# Altium schematic sheet REG_LIN_3V3_1A_TPS78533.SchDoc
size A4; SheetNumber: 4; SheetTotal: 4
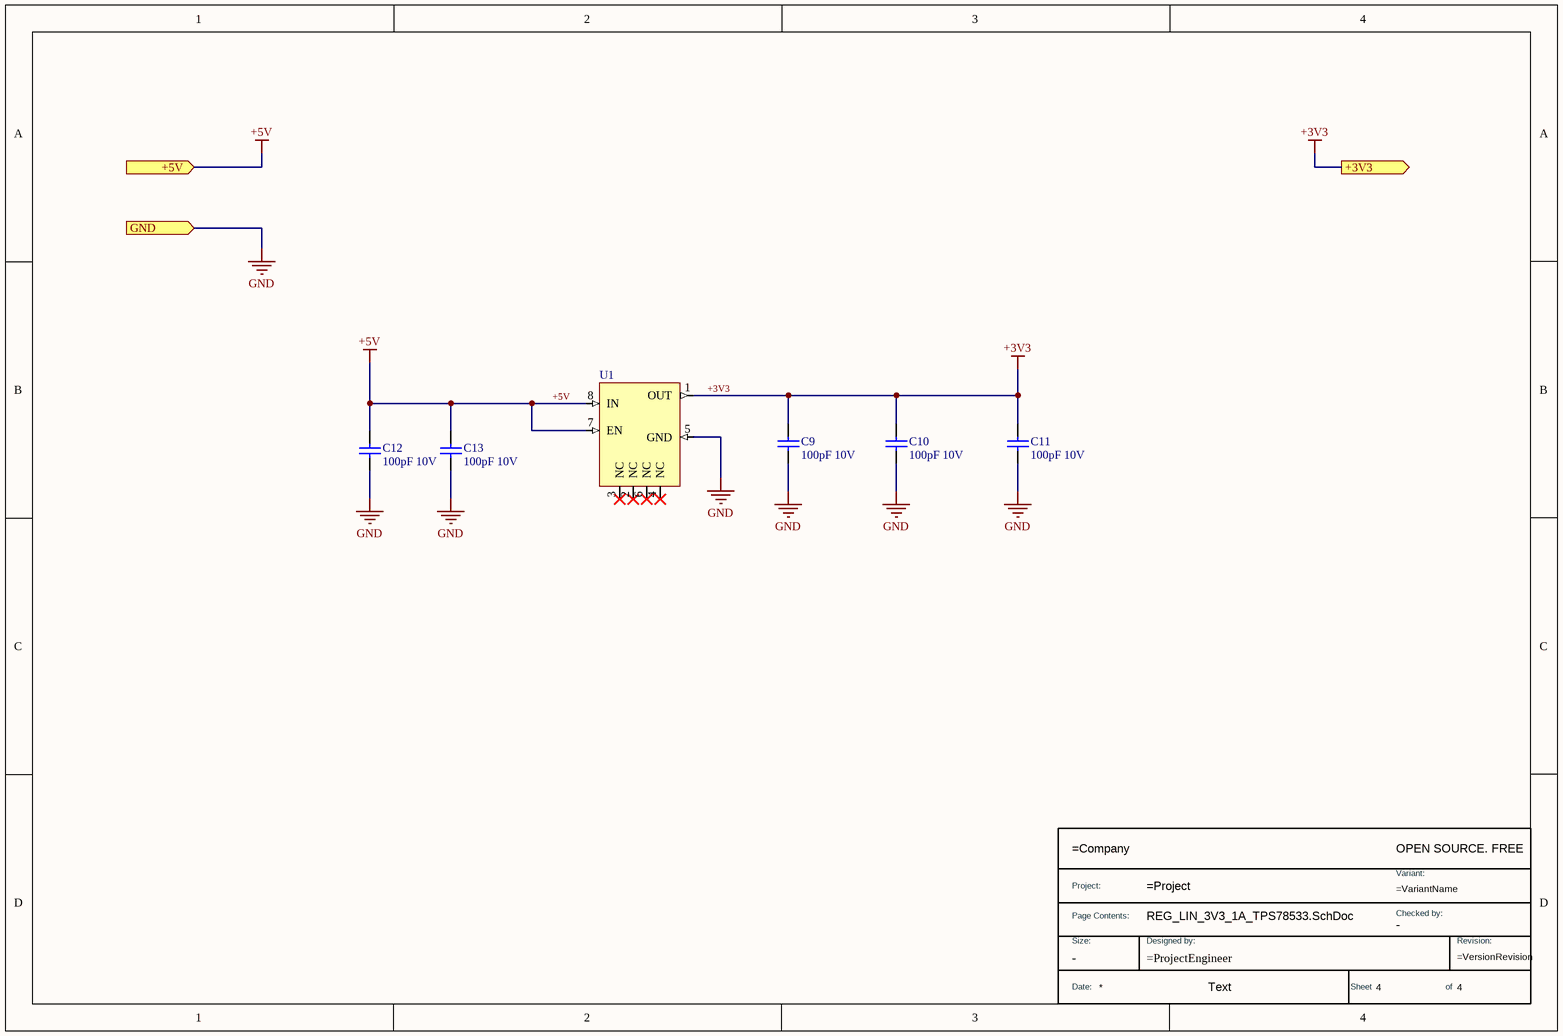
[diagram p0: REG_LIN_3V3_1A_TPS78533.SchDoc]

## Parts
*  TitleBlock  (value not drawn)  (graphical)
C9  value 100pF 10V  (hidden comment: _Capacitor)
C10  value 100pF 10V  (hidden comment: _Capacitor)
C11  value 100pF 10V  (hidden comment: _Capacitor)
C12  value 100pF 10V  (hidden comment: _Capacitor)
C13  value 100pF 10V  (hidden comment: _Capacitor)
U1  TPS78533QWDRBRQ1  (value not drawn)

## Ports
+3V3 (out, see 1[7B]), +5V (in, see 1[6B], 3[4A]), GND (in, see 1[6C], 2[4A], 3[1A])

## Nets
+3V3: C9.1 C10.1 C11.1 U1.1(OUT) ; port +3V3
+5V: C12.1 C13.1 U1.7(EN) U1.8(IN) ; port +5V
GND: C9.2 C10.2 C11.2 C12.2 C13.2 U1.5(GND) ; port GND

Not connected (* = marked no-connect by the designer): U1 2(NC)* 3(NC)* 4(NC)* 6(NC)*

## Notes on the sheet
- Todas as informações e detalhes técnicos deste documento são de inteira propriedade da empresa V2COM,
- não poderão ser copiados, reduzidos ou cedidos a terceiros sem prévia autorização por escrito da mesma.
- Salvo em (D/M/A):
- Página:
- de
- Nome do Projeto:
- https://v2com.com/
- Ed.:
- Responsável:
- Nome da página:
- Rev.:
- Projetista:
- Obs.:
- Revisor:
- Arquivo:
- -
- (in symbol TitleBlock) OPEN SOURCE. FREE; Project:; Variant:; Page Contents:; Checked by:; Size:; Designed by:; Revision:; Date:; Text; Sheet; of

## Library data of the parts
* = TitleBlock: Standard Title Block; DWG NO: =ProjectEngineer; Size: -; Checked by: -
C9-C13 = _Capacitor: Capacitor; Published: 8-Jun-2000; LatestRevisionDate: 17-Jul-2002; LatestRevisionNote: Re-released for DXP Platform.; PackageReference: RAD-0.3; Publisher: Altium Limited; PackageDescription: Radial Cap, Thru-Hole; 2 Leads; 0.3 in Pin Spacing
U1 = TPS78533QWDRBRQ1: Linear Voltage Regulator IC Positive Fixed 1 Output 1A 8-SON (3x3)